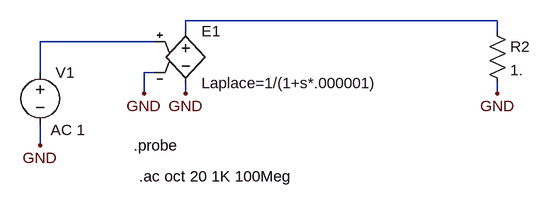
[diagram p0: schematic expr.asc]
expr.asc, the LTspice schematic file:
Version 4
SHEET 1 1464 688
WIRE 704 400 704 352
WIRE 704 480 704 512
WIRE 928 432 928 416
WIRE 1408 432 1408 416
WIRE 928 336 928 320
WIRE 928 320 1408 320
WIRE 1408 320 1408 336
WIRE 880 400 864 400
WIRE 864 400 864 432
WIRE 880 352 704 352
FLAG 704 512 GND
FLAG 1408 432 GND
FLAG 928 432 GND
FLAG 864 432 GND
SYMBOL VOLTAGE 704 384 R0
WINDOW 39 0 0 Left 0
WINDOW 123 16 104 Left 0
SYMATTR InstName V1
SYMATTR Value ""
SYMATTR Value2 AC 1
SYMBOL RES 1392 320 R0
SYMATTR InstName R2
SYMATTR Value 1.
SYMBOL e 928 320 R0
SYMATTR InstName E1
SYMATTR Value Laplace=1/(1+s*.000001)
TEXT 856 560 Left 0 !.ac oct 20 1K 100Meg
text 848 512 Left 0 !.probe

The netlist it stands for:
* expr.asc
V1 N001 GND AC 1
R2 N002 GND 1.
E1 N002 GND N001 GND Laplace=1/(1+s*.000001)
.ac oct 20 1K 100Meg
.probe
.backanno
.end